# EAGLE design tick-shield-mk-1.3 (EAGLE 6.5.0)
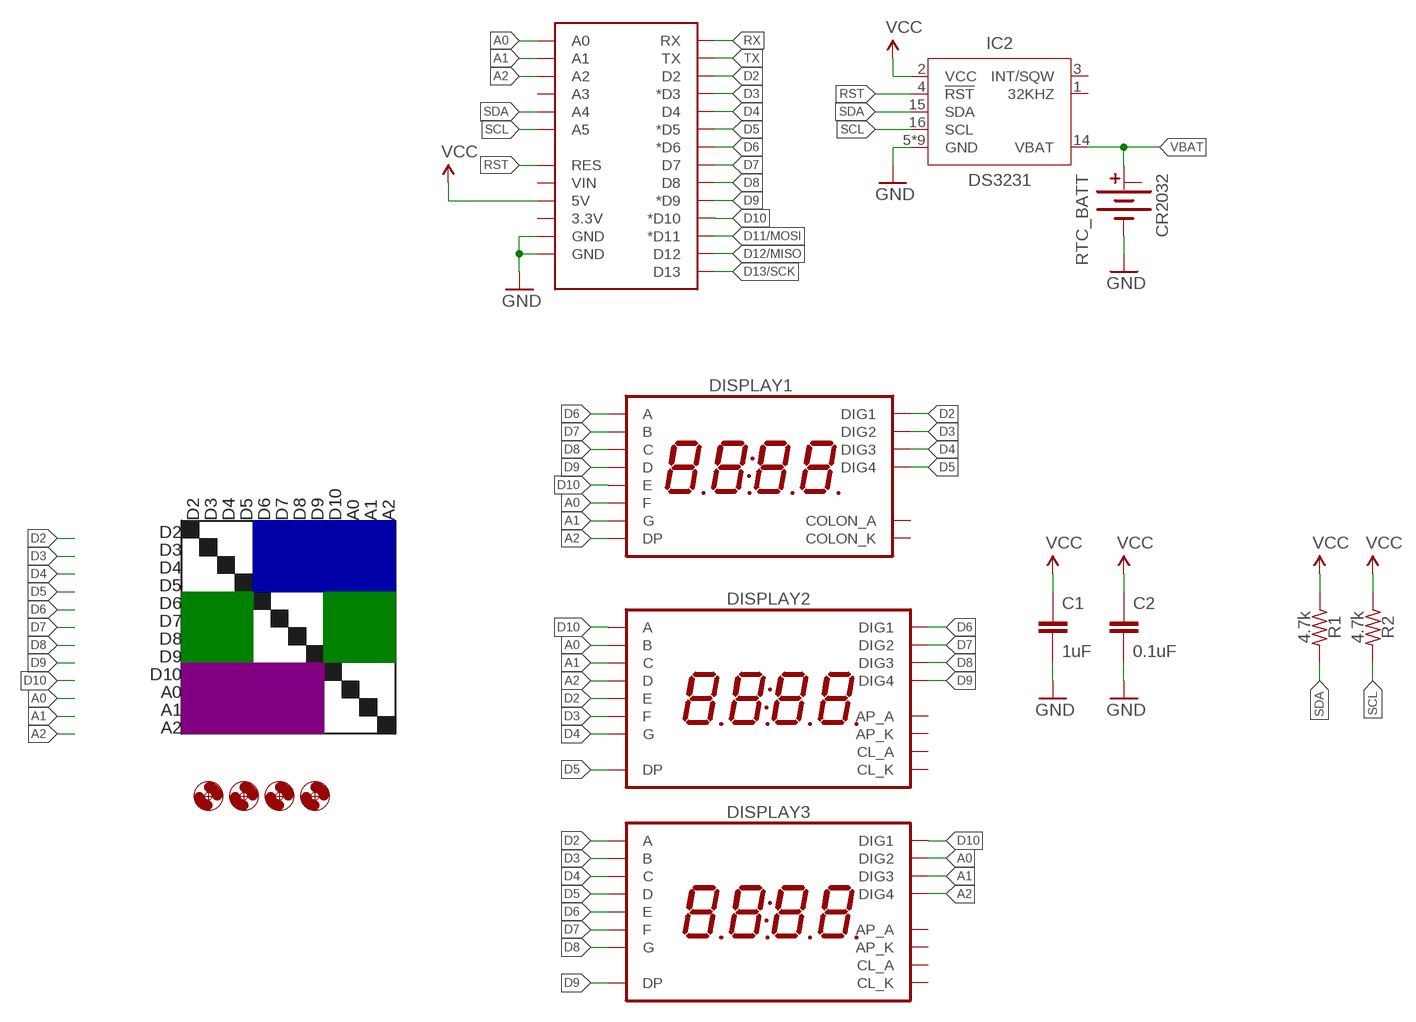
[diagram p0: schematic, sheet 1]

## Parts
C1  1uF  CAPACITOR-CERAMIC025-024X044  [C025-024X044]
C2  0.1uF  CAPACITOR-CERAMIC025-024X044  [C025-024X044]
DISPLAY1  7SEG_4DIGIT_COLON14.2MM-CC-NS  [7SEG_4DIG_NS]
DISPLAY2  7SEG_4DIGIT_COLON_APOS  [7SEG_4DIG_10MM]
DISPLAY3  7SEG_4DIGIT_COLON_APOS  [7SEG_4DIG_10MM]
H1  HOLE#2  [HOLE-#2]
H2  HOLE#2  [HOLE-#2]
H3  HOLE#2  [HOLE-#2]
H4  HOLE#2  [HOLE-#2]
IC2  DS3231  [SO16W]
R1  4.7k  RESISTORPTH-AXIAL-6.35MM  [RESISTOR-AXIAL-PTH-6.35MM]
R2  4.7k  RESISTORPTH-AXIAL-6.35MM  [RESISTOR-AXIAL-PTH-6.35MM]
RTC_BATT  CR2032  BATTERY-COINCR2032_SMD  [BATTCON_20MM_MINE]
U$1  ARDUINO_SHIELD_SMALLER  [ARDUINO_SHIELD_NOOUTLINE_INSIDE_SMALLER]

## Nets
A0: DISPLAY1.P$12(F) DISPLAY2.16(B) DISPLAY3.2(DIG2) U$1.A0
A1: DISPLAY1.P$5(G) DISPLAY2.13(C) DISPLAY3.6(DIG3) U$1.A1
A2: DISPLAY1.P$3(DP) DISPLAY2.3(D) DISPLAY3.8(DIG4) U$1.A2
D2: DISPLAY1.P$14(DIG1) DISPLAY2.5(E) DISPLAY3.14(A) U$1.D2
D3: DISPLAY1.P$11(DIG2) DISPLAY2.11(F) DISPLAY3.16(B) U$1.D3(*D3)
D4: DISPLAY1.P$10(DIG3) DISPLAY2.15(G) DISPLAY3.13(C) U$1.D4
D5: DISPLAY1.P$6(DIG4) DISPLAY2.7(DP) DISPLAY3.3(D) U$1.D5(*D5)
D6: DISPLAY1.P$13(A) DISPLAY2.1(DIG1) DISPLAY3.5(E) U$1.D6(*D6)
D7: DISPLAY1.P$9(B) DISPLAY2.2(DIG2) DISPLAY3.11(F) U$1.D7
D8: DISPLAY1.P$4(C) DISPLAY2.6(DIG3) DISPLAY3.15(G) U$1.D8
D9: DISPLAY1.P$2(D) DISPLAY2.8(DIG4) DISPLAY3.7(DP) U$1.D9(*D9)
D10: DISPLAY1.P$1(E) DISPLAY2.14(A) DISPLAY3.1(DIG1) U$1.D10(*D10)
D11/MOSI: U$1.D11(*D11)
D12/MISO: U$1.D12
D13/SCK: U$1.D13
GND: C1.2 C2.2 IC2.5(GND) IC2.6(GND) IC2.7(GND) IC2.8(GND) IC2.9(GND) IC2.10(GND) IC2.11(GND) IC2.12(GND) IC2.13(GND) RTC_BATT.BOTTOM(-) U$1.GND@0(GND) U$1.GND@1(GND)
RST: IC2.4(!RST) U$1.RES
RX: U$1.RX
SCL: IC2.16(SCL) R2.P$2 U$1.A5
SDA: IC2.15(SDA) R1.P$2 U$1.A4
TX: U$1.TX
VBAT: IC2.14(VBAT) RTC_BATT.TOP@1(+)
VCC: C1.1 C2.1 IC2.2(VCC) R1.P$1 R2.P$1 U$1.5V
Unconnected: DISPLAY1.P$7(COLON_K) DISPLAY1.P$8(COLON_A) DISPLAY2.4(CL_A) DISPLAY2.9(AP_K) DISPLAY2.10(AP_A) DISPLAY2.12(CL_K) DISPLAY3.4(CL_A) DISPLAY3.9(AP_K) DISPLAY3.10(AP_A) DISPLAY3.12(CL_K) IC2.1(32KHZ) IC2.3(INT/SQW) RTC_BATT.TOP@2(+1) U$1.3.3V U$1.A3 U$1.VIN

## Notes on the sheet
- D2 | D3 | D4 | D5 | D6 | D7 | D8 | D9 | D10 | A0 | A1 | A2
- D2
- D3
- D4
- D5
- D6
- D7
- D8
- D9
- D10
- A0
- A1
- A2

## Library data of the parts
C1 C2 = A_butts:CAPACITOR-CERAMIC: CAPACITOR, European symbol
DISPLAY1 = A_butts:7SEG_4DIGIT_COLON
DISPLAY2 DISPLAY3 = A_butts:7SEG_4DIGIT_COLON_APOS
H1-H4 = A_butts:HOLE: MOUNTING HOLE with drill center marker
IC2 = A_butts:DS3231
R1 R2 = A_butts:RESISTOR: RESISTOR, American symbol
RTC_BATT = A_butts:BATTERY-COIN
U$1 = A_butts:ARDUINO_SHIELD_SMALLER

## Board
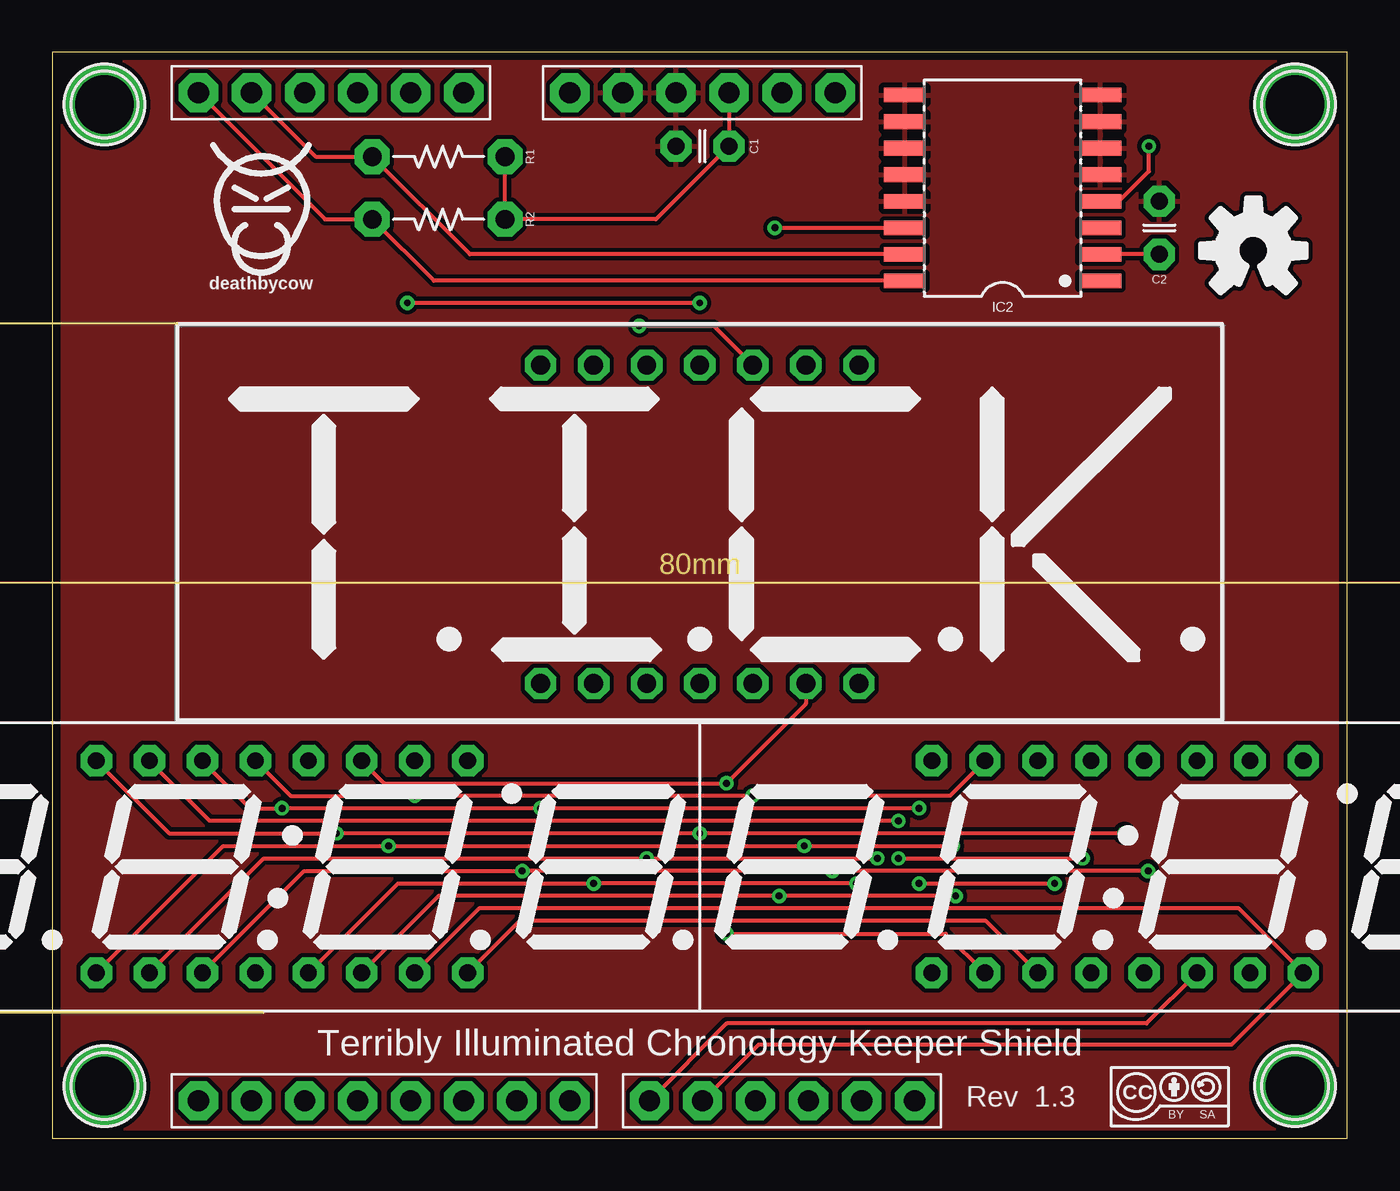
[diagram p1: board, top side]
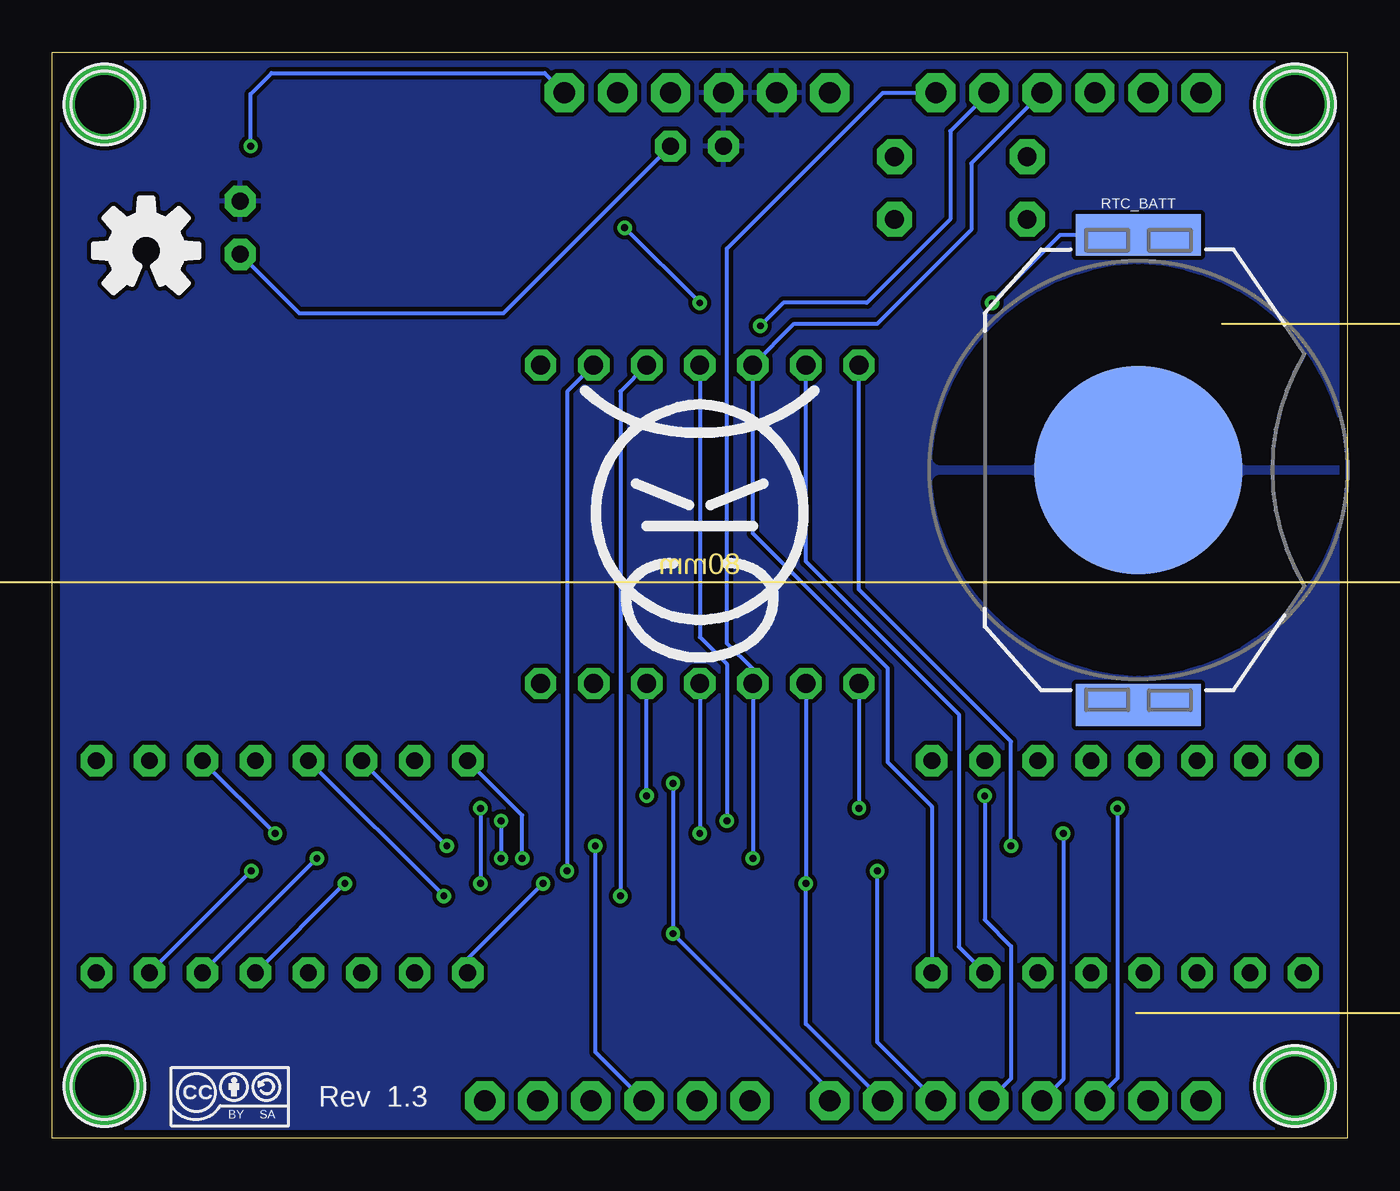
[diagram p2: board, bottom side, seen from below]

Size 62 x 52 mm. Coordinates in mm from the lower left corner, seen from the top.
Outline: 62,52 0,52 0,0 62,0 62,52
Copper layers (1*16): Top 0.0356mm / dielectric 1.5011mm / Bottom 0.0356mm
Design rules "LaenPCBOrder_2": minimum track width 6mil, minimum drill 13mil, track to track 6mil, track to pad 6mil, pad to pad 6mil, via to via 6mil, smd to smd 6mil, copper to edge 15mil, drill to drill 6mil, minimum pad ring 7mil, minimum via ring 7mil, stop-mask expansion 3mil, vias tented up to drill 20mil, thermal gap 10mil
Milling: area -9,26.3 to -7.5,26.9; area 69.5,26.3 to 71,26.9; area 29.4,27 to 32.6,28; area -11.3,37.5 to -10.7,39; area -11.3,6 to -10.7,7.5; area -10.6,20.9 to -9.6,24.1; area -14.5,6 to -13.9,7.5; area -14.5,18.5 to -13.9,20; area -15.6,11.4 to -14.6,14.6; 9 lines

### Footprints (pad centres in the part's own frame; a part is rotated, then mirrored left to right if it is on the bottom)
C025-024X044 = drill 0.813 pad 1.5 octagon: 1 -1.27,0; 2 1.27,0
7SEG_4DIG_NS = drill 0.9 pad 1.5 octagon: P$1 -7.62,7.62; P$2 -5.08,7.62; P$3 -2.54,7.62; P$4 0,7.62; P$5 2.54,7.62; P$6 5.08,7.62; P$7 7.62,7.62; P$8 7.62,-7.62; P$9 5.08,-7.62; P$10 2.54,-7.62; P$11 0,-7.62; P$12 -2.54,-7.62; P$13 -5.08,-7.62; P$14 -7.62,-7.62
7SEG_4DIG_10MM = drill 0.8 pad 1.5 octagon: 1 -8.89,-5.08; 2 -6.35,-5.08; 3 -3.81,-5.08; 4 -1.27,-5.08; 5 1.27,-5.08; 6 3.81,-5.08; 7 6.35,-5.08; 8 8.89,-5.08; 9 8.89,5.08; 10 6.35,5.08; 11 3.81,5.08; 12 1.27,5.08; 13 -1.27,5.08; 14 -3.81,5.08; 15 -6.35,5.08; 16 -8.89,5.08
HOLE-#2 = drill 2.8 pad 3.81: P$1 0,0
SO16W = smd 0.7 x 2: 1 -4.445,-4.685; 2 -3.175,-4.685; 3 -1.905,-4.685; 4 -0.635,-4.685; 5 0.635,-4.685; 6 1.905,-4.685; 7 3.175,-4.685; 8 4.445,-4.685; 9 4.445,4.685; 10 3.175,4.685; 11 1.905,4.685; 12 0.635,4.685; 13 -0.635,4.685; 14 -1.905,4.685; 15 -3.175,4.685; 16 -4.445,4.685
RESISTOR-AXIAL-PTH-6.35MM = drill 0.9 pad 1.676 octagon: P$1 -3.175,0; P$2 3.175,0
BATTCON_20MM_MINE = smd 10 x 10: BOTTOM 0,0 | smd 6 x 2: TOP@1 0,11.25; TOP@2 0,-11.25
ARDUINO_SHIELD_NOOUTLINE_INSIDE_SMALLER = drill 1.016 pad 1.88 octagon: 3.3V 48.26,-27.94; 5V 48.26,-25.4; A0 48.26,-12.7; A1 48.26,-10.16; A2 48.26,-7.62; A3 48.26,-5.08; A4 48.26,-2.54; A5 48.26,0; D2 0,-5.08; D3 0,-7.62; D4 0,-10.16; D5 0,-12.7; D6 0,-15.24; D7 0,-17.78; D8 0,-21.59; D9 0,-24.13; D10 0,-26.67; D11 0,-29.21; D12 0,-31.75; D13 0,-34.29; GND@0 48.26,-22.86; GND@1 48.26,-20.32; RES 48.26,-30.48; RX 0,0; TX 0,-2.54; VIN 48.26,-17.78

### Placement (x,y rotation side)
C1  31.13,47.5 180 top
C2  53,43.59 90 top
DISPLAY1  31,29.4 0 top
DISPLAY2  51,13 0 top
DISPLAY3  11,13 0 top
H1  2.5,2.5 0 top
H2  59.5,2.5 0 top
H3  59.5,49.5 0 top
H4  2.5,49.5 0 top
IC2  45.5,45.5 90 top
R1  18.5,47 180 top
R2  18.5,44 180 top
RTC_BATT  10,32 0 bottom
U$1  7,1.8 90 top
U$2  [TICK_SYMBOL_0.56]  31,29.4 0 top
U$3  [CC-BY-SA-4.0-NO-URL]  53.5,2 0 top
U$4  [CC-BY-SA-4.0-NO-URL]  53.5,2 0 bottom
U$5  [COW]  31,28.8 0 bottom
U$6  [COW_SMALL]  10,45 0 top
U$7  [OSHWLOGO_TOP_0.2_A]  57.5,42.5 0 top
U$8  [OSHWLOGO_TOP_0.2_A]  57.5,42.5 0 bottom

### Tracks (layer width: path | path; a pad name or v marks a point on that pad's centre or on a via)
A0  (via drill 0.33)
  Top 0.2: DISPLAY3.2 10.13,13.4 v28.46,13.4 v39.5,13.4
  Bottom 0.2: v28.46,13.4 DISPLAY1.P$12 28.46,22.46 29.7,23.7 29.7,42.6 22.24,50.06 U$1.A0 | v39.5,13.4 39.5,15.47 DISPLAY2.16
A1  (via drill 0.33)
  Top 0.2: DISPLAY3.6 18.49,11.6 v34.8,11.6 v43.25,11.6 | v28.1,38.9 31.66,38.9 DISPLAY1.P$5
  Bottom 0.2: v43.25,11.6 DISPLAY2.13 | v34.8,11.6 34.8,35.76 DISPLAY1.P$5 | U$1.A1 19,48.22 19,44 23,40 27,40 v28.1,38.9
A2
  Top 0.2: DISPLAY3.8 22.37,10.4 44.71,10.4 DISPLAY2.3
  Bottom 0.2: DISPLAY3.8 19.89,15.89 22,18 22,22.5 28.46,28.96 DISPLAY1.P$3 26.48,39 22.5,39 18,43.5 18,46.68 U$1.A2
D2  (via drill 0.33)
  Top 0.2: DISPLAY3.14 9.47,15.8 v11,15.8 v23.38,15.8 v41.5,15.8 | v41.5,12.2 v47.99,12.2
  Bottom 0.2: v41.5,15.8 v41.5,12.2 | v47.99,12.2 DISPLAY2.5 | DISPLAY1.P$14 v23.38,15.8 | v11,15.8 11,2.88 U$1.D2
D3  (via drill 0.33)
  Top 0.2: DISPLAY3.16 5.59,14.6 v13.6,14.6 v31,14.6 v51.33,14.6
  Bottom 0.2: v51.33,14.6 DISPLAY2.11 | DISPLAY1.P$11 v31,14.6 | v13.6,14.6 13.6,2.82 U$1.D3
D4  (via drill 0.33)
  Top 0.2: DISPLAY3.13 11.41,16.4 v17.36,16.4 v33.54,16.4 42.97,16.4 DISPLAY2.15
  Bottom 0.2: v33.54,16.4 DISPLAY1.P$10 | v17.36,16.4 17.36,10.46 16.1,9.2 16.1,2.86 U$1.D4
D5  (via drill 0.33)
  Top 0.2: DISPLAY3.3 12.07,12.8 v22.5,12.8 v37.35,12.8 v52.47,12.8
  Bottom 0.2: v52.47,12.8 DISPLAY2.7 | v37.35,12.8 37.35,35.75 DISPLAY1.P$6 | U$1.D5 22.5,4.6 v22.5,12.8
D6  (via drill 0.33)
  Top 0.2: DISPLAY3.5 16.55,12.2 v25.92,12.2 v38.5,12.2
  Bottom 0.2: DISPLAY1.P$13 v25.92,12.2 25.92,5.48 U$1.D6 | v38.5,12.2 42.11,8.59 DISPLAY2.1
D7  (via drill 0.33)
  Top 0.2: DISPLAY3.11 15.89,17 v32.28,17 36.08,20.8 DISPLAY1.P$9 | v32.28,9.8 42.77,9.8 DISPLAY2.2
  Bottom 0.2: v32.28,17 v32.28,9.8 24.78,2.3 U$1.D7
D8  (via drill 0.33)
  Top 0.2: DISPLAY3.15 7.53,15.2 v29.7,15.2 v40.51,15.2 | v40.51,13.4 v49.33,13.4 | DISPLAY2.6 52.39,5.5 32.29,5.5 U$1.D8
  Bottom 0.2: v40.51,15.2 v40.51,13.4 | v49.33,13.4 DISPLAY2.6 | DISPLAY1.P$4 31,24 29.7,22.7 v29.7,15.2
D9
  Top 0.2: DISPLAY3.7 20.43,11 56.81,11 DISPLAY2.8 56.47,4.5 33.83,4.5 U$1.D9
  Bottom 0.2: DISPLAY3.7 18.6,9.17 18.6,20.3 25.92,27.62 DISPLAY1.P$2
D10  (via drill 0.33)
  Top 0.2: DISPLAY3.1 8.19,14 v16.1,14 v36,14 v43.11,14
  Bottom 0.2: v43.11,14 DISPLAY2.14 | v16.1,14 16.1,19 23.38,26.28 DISPLAY1.P$1 | U$1.D10 36,4.13 v36,14
GND
  pour Top (isolate 0.2): 62,52 62,0 0,0 0,52
  pour Bottom (isolate 0.2): 62,52 62,0 0,0 0,52
RST  (via drill 0.33)
  Top 0.2: IC2.4 51.06,44.87 52.5,46.3 v52.5,47.5
  Bottom 0.2: v52.5,47.5 52.5,50 51.5,51 38.42,51 U$1.RES
SCL
  Top 0.2: IC2.16 18.27,41.05 R2.P$2 13.06,44 U$1.A5
SDA
  Top 0.2: IC2.15 20,42.33 R1.P$2 12.6,47 U$1.A4
VBAT  (via drill 0.33)
  Top 0.2: v17,40 v31,40 | v34.59,43.59 IC2.14
  Bottom 0.2: RTC_BATT.TOP@1 13.75,43.25 v17,40 | v31,40 v34.59,43.59
VCC
  Top 0.2: U$1.5V C1.1 28.9,44 R2.P$1 R1.P$1 | C2.1 IC2.2
  Bottom 0.2: C1.1 40.4,39.5 50.17,39.5 C2.1

### Text on the board
tPlace: Terribly Illuminated Chronology Keeper Shield | Rev
bPlace: Rev